# Altium schematic sheet 12V_Buck.SchDoc
size A4; SheetNumber: 3; SheetTotal: 6
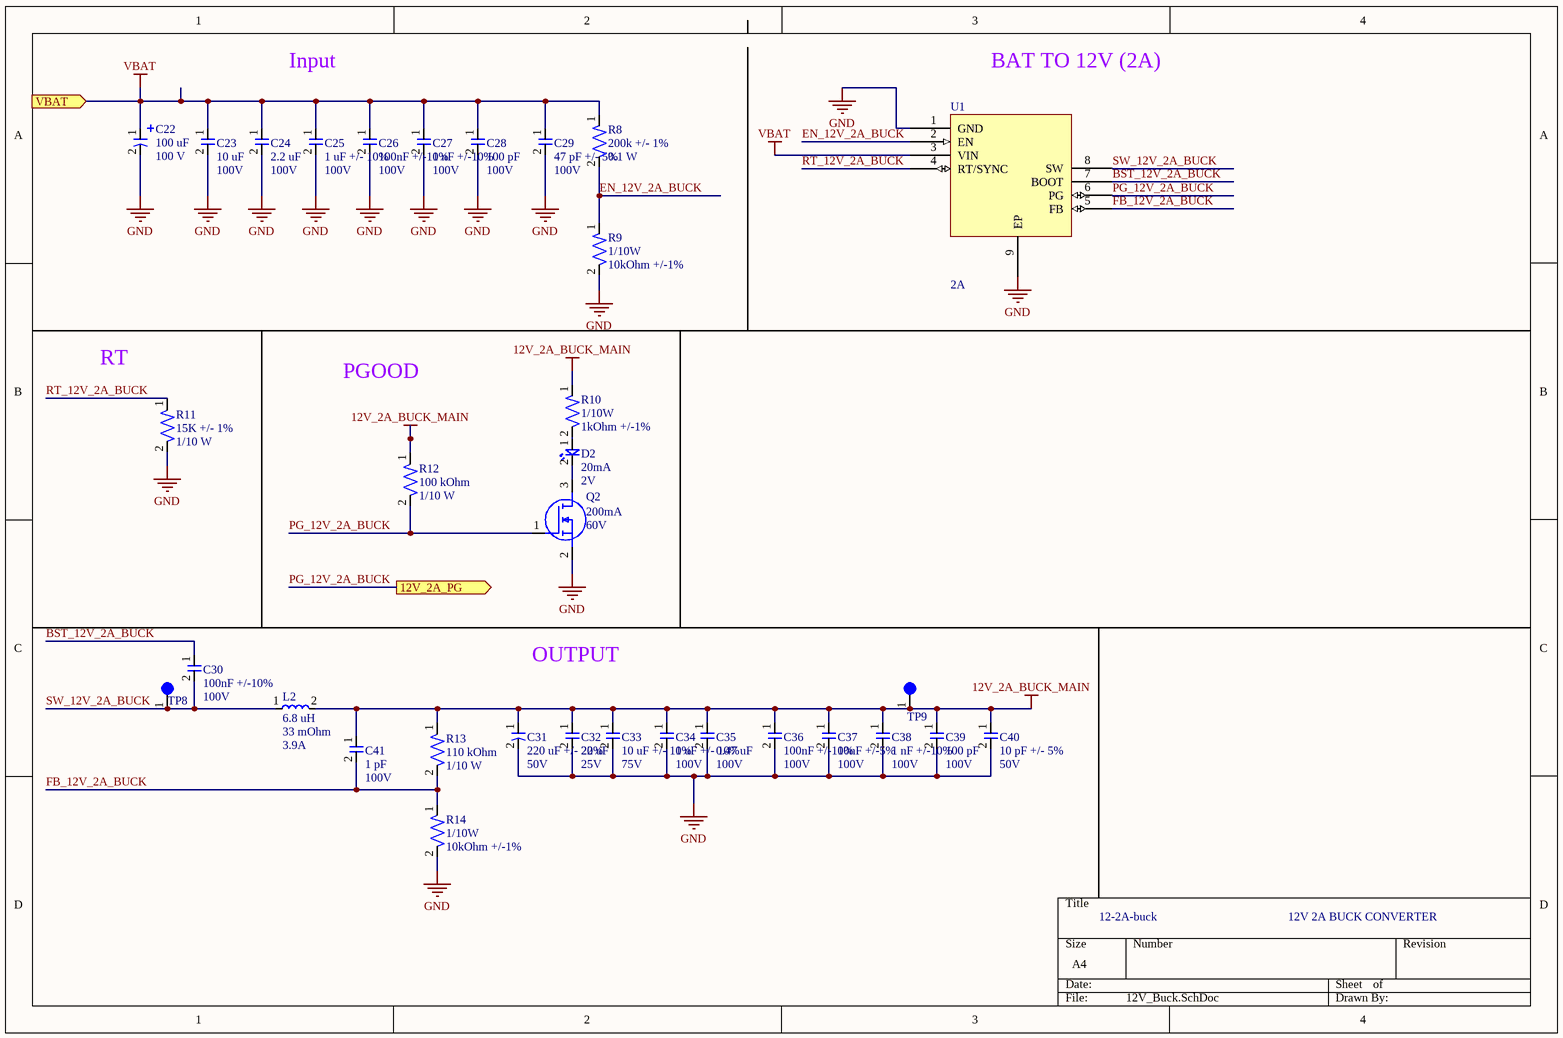
[diagram p0: 12V_Buck.SchDoc]

## Parts
C22  Capacitance: 100 uF  Voltage: 100 V  [ELEC-100U-0001]  (hidden comment: 100SEV100M12.5X16)
C23  Capcitance: 10 uF  Voltage Rating: 100V  [CAP-1210]  (hidden comment: GRM32EC72A106KE05L)
C24  Capacitance: 2.2 uF  Voltage: 100V  [CAP-1206]  (hidden comment: CL31B225KCHSNNE)
C25  Capacitance: 1 uF +/- 10%  Voltage: 100V  [CAP-1206 - duplicate]  (hidden comment: CL31B105KCHNNNE)
C26  Capacitance: 100nF +/-10%  Voltage Rating: 100V  [CAP-0603]  (hidden comment: CC0603KRX7R0BB104)
C27  Capacitance: 1 nF +/-10%  Voltage: 100V  [CAP-0603]  (hidden comment: C0603Y102K1RAC7867)
C28  Capacitance: 100 pF  Voltage: 100V  [CAP-0603]  (hidden comment: 0603N101J101CT)
C29  Capacitance: 47 pF +/- 5%  Voltage Rating: 100V  [CAP-0603]  (hidden comment: 7447798111)
C30  Capacitance: 100nF +/-10%  Voltage Rating: 100V  [CAP-0603]  (hidden comment: CC0603KRX7R0BB104)
C31  Capacitance: 220 uF +/- 20%  Voltage Rating: 50V  [ELEC-220U-0003]  (hidden comment: 50TZV220M10X10.5)
C32  Capacitance: 22 uF  Voltage: 25V  [CAP-1210]  (hidden comment: CL32B226KAJNNNE)
C33  Capacitance: 10 uF +/- 10%  Voltage Rating: 75V  [CAP-1210]  (hidden comment: C3225X7R1N106K250AC)
C34  Capacitance: 1 uF +/- 10%  Voltage: 100V  [CAP-1206 - duplicate]  (hidden comment: CL31B105KCHNNNE)
C35  Capacitance: 0.47 uF  Voltage: 100V  [CAP-0805]  (hidden comment: KAM21KR72A474KL)
C36  Capacitance: 100nF +/-10%  Voltage Rating: 100V  [CAP-0603]  (hidden comment: CC0603KRX7R0BB104)
C37  Capacitance: 10nF +/-5%  Voltage Rating: 100V  [CAP-0603]  (hidden comment: C1608C0G2A103J080AC)
C38  Capacitance: 1 nF +/-10%  Voltage: 100V  [CAP-0603]  (hidden comment: C0603Y102K1RAC7867)
C39  Capacitance: 100 pF  Voltage: 100V  [CAP-0603]  (hidden comment: 0603N101J101CT)
C40  Capacitance: 10 pF +/- 5%  Voltage Rating: 50V  [CAP-0603]  (hidden comment: 0603N100J500CT)
C41  Capacitance: 1 pF  Voltage: 100V  [CAP-0603]  (hidden comment: 885012006087)
D2  Current Rating: 20mA  Vf: 2V  [LED-0603]  (hidden comment: 150060AS75000)
L2  Inductance: 6.8 uH  DCR: 33 mOhm  DCI: 3.9A  [PWRIND-6.8U-0001]  (hidden comment: SRN8040-6R8Y)
Q2  Id-Continuous: 200mA  VDS-Max: 60V  [NMOS-SOT23-3]  (hidden comment: T2N7002AK,LM)
R8  Resistance: 200k +/- 1%  Power Rating: 0.1 W  [RES-0603]  (hidden comment: ERJ-3EKF2003V)
R9  Power Rating: 1/10W  Resistance: 10kOhm +/-1%  [RES-0603]  (hidden comment: RC0603FR-0710KP)
R10  Power Rating: 1/10W  Resistance: 1kOhm +/-1%  [RES-0603]  (hidden comment: RT0603FRE131KL)
R11  Res: 15K +/- 1%  Power: 1/10 W  [RES-0402]  (hidden comment: ERJ-2RKF1502X)
R12  Resistance: 100 kOhm  Power: 1/10 W  [RES-0603]  (hidden comment: RC0603FR-07100KL)
R13  Resistance: 110 kOhm  Power: 1/10 W  [RES-0603]  (hidden comment: RC0603FR-07110KL)
R14  Power Rating: 1/10W  Resistance: 10kOhm +/-1%  [RES-0603]  (hidden comment: RC0603FR-0710KP)
TP8  5003  [TEST-POINT-0001]  (value not drawn)
TP9  5003  [TEST-POINT-0001]  (value not drawn)
U1  Current: 2A  [IC-8PowerSOIC]  (hidden comment: LMR38020SDDAR)

## Ports
12V_2A_PG (out), VBAT (in)

## Nets
12V_2A_BUCK_MAIN: C31.1 C32.1 C33.1 C34.1 C35.1 C36.1 C37.1 C38.1 C39.1 C40.1 C41.1 L2.2 R10.1 R12.1 R13.1 TP9.1
GND: C22.2 C23.2 C24.2 C25.2 C26.2 C27.2 C28.2 C29.2 C31.2 C32.2 C33.2 C34.2 C35.2 C36.2 C37.2 C38.2 C39.2 C40.2 Q2.2(S) R9.2 R11.2 R14.2 U1.1(GND) U1.9(EP)
VBAT: C22.1 C23.1 C24.1 C25.1 C26.1 C27.1 C28.1 C29.1 R8.1 U1.3(VIN) ; port VBAT
BST_12V_2A_BUCK: C30.1 U1.7(BOOT)
EN_12V_2A_BUCK: R8.2 R9.1 U1.2(EN)
FB_12V_2A_BUCK: C41.2 R13.2 R14.1 U1.5(FB)
PG_12V_2A_BUCK: Q2.1(G) R12.2 U1.6(PG) ; port 12V_2A_PG
RT_12V_2A_BUCK: R11.1 U1.4(RT/SYNC)
SW_12V_2A_BUCK: C30.2 L2.1 TP8.1 U1.8(SW)
NetD2_1: D2.1 R10.2
NetD2_2: D2.2 Q2.3(D)

## Notes on the sheet
- Input
- BAT TO 12V (2A)
- RT
- PGOOD
- OUTPUT
- 12-2A-buck
- 12V 2A BUCK CONVERTER

## Library data of the parts
C22 = ELEC-100U-0001: 100 µF 100 V Aluminum Electrolytic Capacitors Radial, Can - SMD 2000 Hrs @ 85°C; Manufacturer: Rubycon; Tolerance: +/- 20%; Assembled?: No; ESR: idk check the datasheet i couldnt find it
C23 = CAP-10U-0003: 10 µF ±10% 100V Ceramic Capacitor X7S 1210 (3225 Metric); Package Size: 1210
C24 = CAP-2.2U-0003: 2.2 µF ±10% 100V Ceramic Capacitor X7R 1206 (3216 Metric); Manufacturer: Samsung Electro-Mechanics; Tolerance: +/- 10%; Assembled?: No; Manufacturer Part Number: CL31B225KCHSNNE; Temperature Coefficient: X7R; Package Size: 1206
C25 C34 = CAP-1U-0001: 1 µF ±10% 100V Ceramic Capacitor X7R 1206 (3216 Metric)
C26 C30 C36 = CAP-100N-0001: CAP CER 0.1UF 100V X7R 0603; Manufacturer: YAGEO; Assembled?: no; Manufacturer Part Number: CC0603KRX7R0BB104; Temperature Coefficient: X7R; Package Size: 0603
C27 C38 = CAP-1N-0001: 1000 pF ±10% 100V Ceramic Capacitor X7R 0603 (1608 Metric)
C28 C39 = CAP-100P-0002: 100 pF ±5% 100V Ceramic Capacitor C0G, NP0 0603 (1608 Metric); Tolerance: +/-5%; Temp Coeff: C0G/NP0; Package Size: 0603
C29 = CAP-47P-0001: 47 pF ±5% 100V Ceramic Capacitor C0G, NP0 0603 (1608 Metric)
C31 = ELEC-220U-0003: 220 µF 50 V Aluminum Electrolytic Capacitors Radial, Can - SMD 2000 Hrs @ 105°C; Size: .406inx.406in*.413in
C32 = CAP-22U-0003: 22 µF ±10% 25V Ceramic Capacitor X7R 1210 (3225 Metric); Tolerance: +/- 10%; Assembled?: No; Temperature Coefficient: X7R; Package Size: 1210
C33 = CAP-10U-0004: 10 µF ±10% 75V Ceramic Capacitor X7R 1210 (3225 Metric)
C35 = CAP-0.47U-0001: 0.47 µF ±10% 100V Ceramic Capacitor X7R 0805 (2012 Metric); Tolerance: +/- 10%; Assembled?: No; Temperature Coefficient: X7R; Package Size: 0805
C37 = CAP-10N-0002: CAP CER 10000PF 100V C0G 0603; Manufacturer: TDK Corporation; Temperature Coefficient: C0G/NP0; Assembled?: no; Manufacturer Part Number: C1608C0G2A103J080AC; Package Size: 0603
C40 = CAP-10P-0001: 10 pF ±5% 50V Ceramic Capacitor C0G, NP0 0603 (1608 Metric); Manufacturer: Walshin Technology Corporation; Assembled?: Yes; Manufacturer Part Number: 0603N100J500CT; Temperature Coefficient: C0G, NP0; Package Size: 0603
C41 = CAP-1P-0001: 1 pF ±0.25pF 100V Ceramic Capacitor C0G, NP0 0603 (1608 Metric); Tolerance: +/- 0.25 pF; Temperature Coefficient: C0G/NP0; Assembled?: No; Package Size: 0603
D2 = LED_Amber_0001: CAP CER 0.1UF 100V X7R 0603; Manufacturer: Wurth Electronik; Assembled?: no; Color: Amber; Manufacturer Part Number: 150060AS75000; Package Size: 0603
L2 = PWRIND-6.8U-0001: 6.8 µH Semi-Shielded Drum Core, Wirewound Inductor 3.9 A 33mOhm Max Nonstandard; Isat: 4.2A; Tolerance: 30%; Assembled?: No
Q2 = NMOS-200MA-0001: MOSFET N-CH 60V 200MA SOT23; Manufacturer: Toshiba; FET type: N-Channel; Rds On-Max: 3.9Ohm; Vgs-Max: 20V; Assembled?: no; Manufacturer Part Number: T2N7002AK,LM; Package: SOT-23-3
R8 = RES-200K-0001: 200 kOhms ±1% 0.1W, 1/10W Chip Resistor 0603 (1608 Metric) Automotive AEC-Q200 Thick Film; Manufacturer: Panasonic Electronic Components; Assembled?: Yes; MFP: ERJ-3EKF2003V; Package SIze: 0603
R9 R14 = RES-10K-0002: RES SMD 10K OHM 1% 1/10W 0603; Manufacturer: YAGEO; Assembled?: no; Manufacturer Part Number: RC0603FR-0710KP; Package Size: 0603
R10 = RES-1K-0002: 1 kOhms ±1% 0.1W, 1/10W Chip Resistor 0603 (1608 Metric) Thin Film; Manufacturer: YAGEO; Assembled?: no; Manufacturer Part Number: RT0603FRE131KL; Package Size: 0603
R11 = RES-15K-0001: 15 kOhms ±1% 0.1W, 1/10W Chip Resistor 0402 (1005 Metric) Automotive AEC-Q200 Thick Film
R12 = RES-100K-0003: 100 kOhms ±1% 0.1W, 1/10W Chip Resistor 0603 (1608 Metric) Moisture Resistant Thick Film; Tolerance: +/- 1%; Assembled?: No; Package Size: 0603
R13 = RES-110K-0001: 110 kOhms ±1% 0.1W, 1/10W Chip Resistor 0603 (1608 Metric) Moisture Resistant Thick Film; Tolerance: +/- 1%; Assembled?: No; Package Size: 0603
TP8 TP9 = TEST-POINT-0001: Oranange PC Test Point, Miniature Phoisphor Bronze Silver Plating Through Hole Mounting Type
U1 = IC-BUCK-0007: Buck Switching Regulator IC Positive Adjustable 1V 1 Output 2A 8-PowerSOIC (0.154", 3.90mm Width); Manufactuer: Texas Instruments; Assembled?: no; Manufacturer Part Number: LMR38020SDDAR; Type: Buck; Package: 8-PowerSOIC